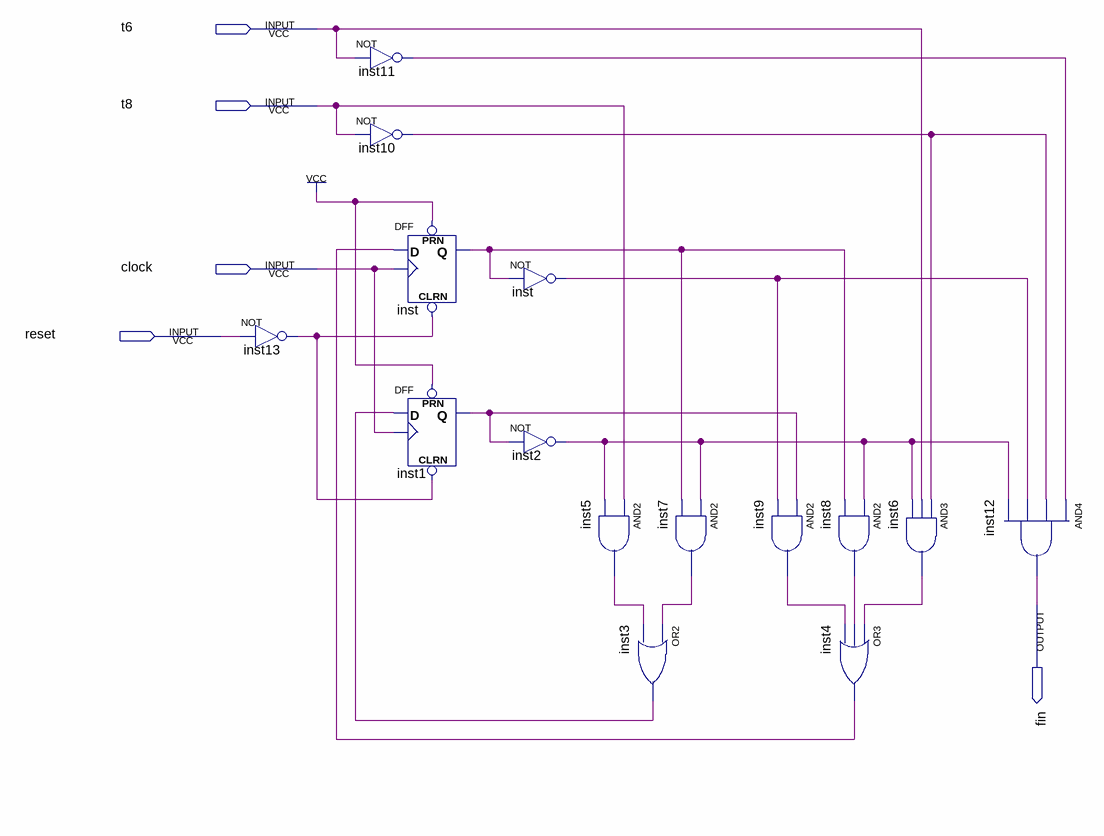
[diagram p0: schematic sheet]
// Quartus schematic timer_t6_t8.bdf as structural Verilog: 15 symbols, 5 pins
module timer_t6_t8 (
  input  t6,
  input  t8,
  input  clock,
  input  reset,
  output fin
);

  wire inst1_q, inst2_out, inst3_out, inst4_out, inst5_out, inst6_out, inst7_out, inst8_out, inst9_out,
       inst10_out, inst11_out, inst13_out, inst_out, inst_q;

  not inst13 (inst13_out, reset);
  not inst11 (inst11_out, t6);
  not inst10 (inst10_out, t8);
  DFF inst (.CLRN(inst13_out), .CLK(clock), .D(inst4_out), .PRN(1'b1), .Q(inst_q));
  DFF inst1 (.CLRN(inst13_out), .CLK(clock), .D(inst3_out), .PRN(1'b1), .Q(inst1_q));
  not inst_dup2 (inst_out, inst_q);
  not inst2 (inst2_out, inst1_q);
  and inst5 (inst5_out, t8, inst2_out);
  or inst3 (inst3_out, inst7_out, inst5_out);
  and inst7 (inst7_out, inst2_out, inst_q);
  and inst9 (inst9_out, inst1_q, inst_out);
  and inst8 (inst8_out, inst2_out, inst_q);
  or inst4 (inst4_out, inst6_out, inst8_out, inst9_out);
  and inst6 (inst6_out, inst10_out, t6, inst2_out);
  and inst12 (fin, inst11_out, inst10_out, inst_out, inst2_out);
endmodule
